# Altium schematic sheet uMultimeter__Sch_View.SchDoc
size A4; PageSetup: Record=PageOptions|CenterHorizontal=True|CenterVertical=True|PrintScale=1.00|XCorrection=1.00|YCorrection=1.00|PrintKind=0|BorderSize=5000000|LeftOffset=0|BottomOffset=0|Orientation=2|PaperLength=1000|PaperWidth=1000|Scale=100|PaperSource=7|PrintQuality=-3|MediaType=1|DitherType=10|PrintScaleMode=0|PaperKind=A4|PaperIndex=9
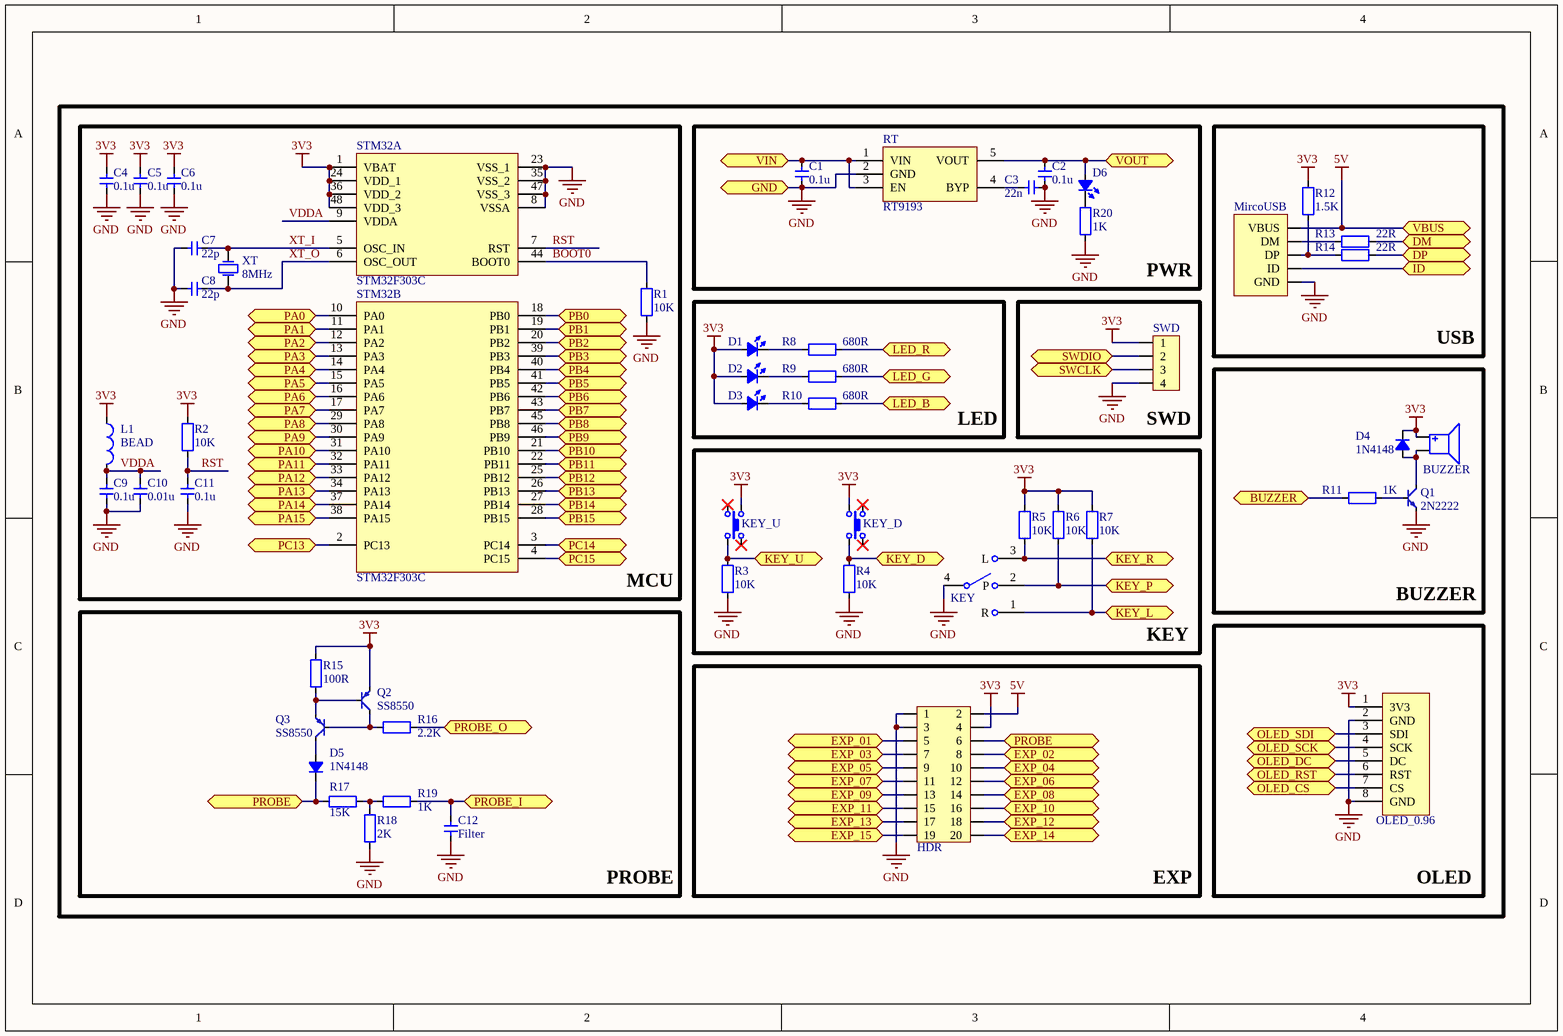
[diagram p0: uMultimeter__Sch_View.SchDoc]

## Parts
BUZZER  Buzzer  [Buzzer_5x5]  (value not drawn)
C1  value 0.1u  [CAP_0603]  (hidden comment: Cap_0603)
C2  value 0.1u  [CAP_0603]  (hidden comment: Cap_0603)
C3  value 22n  [CAP_0603]  (hidden comment: Cap_0603)
C4  value 0.1u  [CAP_0603]  (hidden comment: Cap_0603)
C5  value 0.1u  [CAP_0603]  (hidden comment: Cap_0603)
C6  value 0.1u  [CAP_0603]  (hidden comment: Cap_0603)
C7  value 22p  [CAP_0603]  (hidden comment: Cap_0603)
C8  value 22p  [CAP_0603]  (hidden comment: Cap_0603)
C9  value 0.1u  [CAP_0603]  (hidden comment: Cap_0603)
C10  value 0.01u  [CAP_0603]  (hidden comment: Cap_0603)
C11  value 0.1u  [CAP_0603]  (hidden comment: Cap_0603)
C12  value Filter  [CAP_0603]  (hidden comment: Cap_0603)
D1  LED_0805  [LED_0805_RED]  (value not drawn)
D2  LED_0805  [LED_0805_GREEN]  (value not drawn)
D3  LED_0805  [LED_0805_BLUE]  (value not drawn)
D4  value 1N4148  [SOD-323]  (hidden comment: Diode_SOD323)
D5  value 1N4148  [SOD-323]  (hidden comment: Diode_SOD323)
D6  LED_0805  [LED_0805_ORANGE]  (value not drawn)
HDR  HDR2x10_2.54  [HDR2X10_2.54_180HF]  (value not drawn)
KEY  ButtonPushLever_11*12_90  [ButtonPushLever_11*12_90]  (value not drawn)
KEY_D  ButtonTACT  [ButtonTACT_3.5*3.55_90]  (value not drawn)
KEY_U  ButtonTACT  [ButtonTACT_3.5*3.55_90]  (value not drawn)
L1  value BEAD  [IND_0603]  (hidden comment: Ind_0603)
MircoUSB  USB_Micro  [USB_Micro-AB]  (value not drawn)
OLED_0.96  OLED_0.96  [OLED_0.96_96x64_v2]  (value not drawn)
Q1  value 2N2222  [SOT23-3]  (hidden comment: BJT_NPN)
Q2  value SS8550  [SOT23-3]  (hidden comment: BJT_PNP)
Q3  value SS8550  [SOT23-3]  (hidden comment: BJT_PNP)
R1  value 10K  [RES_0603]  (hidden comment: Res_0603)
R2  value 10K  [RES_0603]  (hidden comment: Res_0603)
R3  value 10K  [RES_0603]  (hidden comment: Res_0603)
R4  value 10K  [RES_0603]  (hidden comment: Res_0603)
R5  value 10K  [RES_0603]  (hidden comment: Res_0603)
R6  value 10K  [RES_0603]  (hidden comment: Res_0603)
R7  value 10K  [RES_0603]  (hidden comment: Res_0603)
R8  value 680R  [RES_0603]  (hidden comment: Res_0603)
R9  value 680R  [RES_0603]  (hidden comment: Res_0603)
R10  value 680R  [RES_0603]  (hidden comment: Res_0603)
R11  value 1K  [RES_0603]  (hidden comment: Res_0603)
R12  value 1.5K  [RES_0603]  (hidden comment: Res_0603)
R13  value 22R  [RES_0603]  (hidden comment: Res_0603)
R14  value 22R  [RES_0603]  (hidden comment: Res_0603)
R15  value 100R  [RES_0603]  (hidden comment: Res_0603)
R16  value 2.2K  [RES_0603]  (hidden comment: Res_0603)
R17  value 15K  [RES_0603]  (hidden comment: Res_0603)
R18  value 2K  [RES_0603]  (hidden comment: Res_0603)
R19  value 1K  [RES_0603]  (hidden comment: Res_0603)
R20  value 1K  [RES_0603]  (hidden comment: Res_0603)
RT  RT9193  [SOT23-5]
STM32  STM32F303C  [LQFP_P0.5_48]  (parts A,B of 2)
SWD  HDR1x4_1.27  [HDR1X4_1.27_180]  (value not drawn)
XT  value 8MHz  [XT_5032_2]  (hidden comment: XTAL_5032_2P)

## Blocks framed on the sheet
MCU: C4-C11 L1 R1 R2 STM32 XT
PWR: C1-C3 D6 R20 RT
USB: MircoUSB R12-R14
LED: D1-D3 R8-R10
SWD: SWD
BUZZER: BUZZER D4 Q1 R11
KEY: KEY KEY_D KEY_U R3-R7
PROBE: C12 D5 Q2 Q3 R15-R19
OLED: OLED_0.96
EXP: HDR

## Ports
BUZZER, DM, DP, EXP_01, EXP_02, EXP_03, EXP_04, EXP_05, EXP_06, EXP_07, EXP_08, EXP_09, EXP_10, EXP_11, EXP_12, EXP_13, EXP_14, EXP_15, GND, ID, KEY_D, KEY_L, KEY_P, KEY_R, KEY_U, LED_B, LED_G, LED_R, OLED_CS, OLED_DC, OLED_RST, OLED_SCK, OLED_SDI, PA0, PA1, PA2, PA3, PA4, PA5, PA6, PA7, PA8, PA9, PA10, PA11, PA12, PA13, PA14, PA15, PB0, PB1, PB2, PB3, PB4, PB5, PB6, PB7, PB8, PB9, PB10, PB11, PB12, PB13, PB14, PB15, PC13, PC14, PC15, PROBE, PROBE_I, PROBE_O, SWCLK, SWDIO, VBUS, VIN, VOUT

## Nets
3V3: BUZZER.P(Positive) C4.2 C5.2 C6.2 D1.1(A) D2.1(A) D3.1(A) D4.2(K) HDR.4 KEY_D.3 KEY_U.1 L1.1 OLED_0.96.1(3V3) Q2.2(E) R2.2 R5.2 R6.2 R7.2 R12.1 R15.2 STM32.1(VBAT) STM32.24(VDD_1) STM32.36(VDD_2) STM32.48(VDD_3) SWD.1
5V: HDR.2 MircoUSB.1(VBUS) ; port VBUS
GND: C1.1 C2.1 C3.1 C4.1 C5.1 C6.1 C7.2 C8.2 C9.1 C10.1 C11.1 C12.1 HDR.1 HDR.3 KEY.4 MircoUSB.5(GND) OLED_0.96.2(GND) OLED_0.96.8(GND) Q1.2(E) R1.1 R3.1 R4.1 R18.2 R20.2 RT.2(GND) STM32.8(VSSA) STM32.23(VSS_1) STM32.35(VSS_2) STM32.47(VSS_3) SWD.4 ; port GND
BOOT0: R1.2 STM32.44(BOOT0)
BUZZER: R11.2 ; port BUZZER
DM: R13.2 ; port DM
DP: R14.2 ; port DP
EXP_01: HDR.5 ; port EXP_01
EXP_02: HDR.8 ; port EXP_02
EXP_03: HDR.7 ; port EXP_03
EXP_04: HDR.10 ; port EXP_04
EXP_05: HDR.9 ; port EXP_05
EXP_06: HDR.12 ; port EXP_06
EXP_07: HDR.11 ; port EXP_07
EXP_08: HDR.14 ; port EXP_08
EXP_09: HDR.13 ; port EXP_09
EXP_10: HDR.16 ; port EXP_10
EXP_11: HDR.15 ; port EXP_11
EXP_12: HDR.18 ; port EXP_12
EXP_13: HDR.17 ; port EXP_13
EXP_14: HDR.20 ; port EXP_14
EXP_15: HDR.19 ; port EXP_15
ID: MircoUSB.4(ID) ; port ID
KEY_D: KEY_D.4 R4.2 ; port KEY_D
KEY_L: KEY.1(R) R7.1 ; port KEY_L
KEY_P: KEY.2(P) R6.1 ; port KEY_P
KEY_R: KEY.3(L) R5.1 ; port KEY_R
KEY_U: KEY_U.4 R3.2 ; port KEY_U
LED_B: R10.2 ; port LED_B
LED_G: R9.1 ; port LED_G
LED_R: R8.1 ; port LED_R
OLED_CS: OLED_0.96.7(CS) ; port OLED_CS
OLED_DC: OLED_0.96.5(DC) ; port OLED_DC
OLED_RST: OLED_0.96.6(RST) ; port OLED_RST
OLED_SCK: OLED_0.96.4(SCK) ; port OLED_SCK
OLED_SDI: OLED_0.96.3(SDI) ; port OLED_SDI
PA0: STM32.10(PA0) ; port PA0
PA1: STM32.11(PA1) ; port PA1
PA2: STM32.12(PA2) ; port PA2
PA3: STM32.13(PA3) ; port PA3
PA4: STM32.14(PA4) ; port PA4
PA5: STM32.15(PA5) ; port PA5
PA6: STM32.16(PA6) ; port PA6
PA7: STM32.17(PA7) ; port PA7
PA8: STM32.29(PA8) ; port PA8
PA9: STM32.30(PA9) ; port PA9
PA10: STM32.31(PA10) ; port PA10
PA11: STM32.32(PA11) ; port PA11
PA12: STM32.33(PA12) ; port PA12
PA13: STM32.34(PA13) ; port PA13
PA14: STM32.37(PA14) ; port PA14
PA15: STM32.38(PA15) ; port PA15
PB0: STM32.18(PB0) ; port PB0
PB1: STM32.19(PB1) ; port PB1
PB2: STM32.20(PB2) ; port PB2
PB3: STM32.39(PB3) ; port PB3
PB4: STM32.40(PB4) ; port PB4
PB5: STM32.41(PB5) ; port PB5
PB6: STM32.42(PB6) ; port PB6
PB7: STM32.43(PB7) ; port PB7
PB8: STM32.45(PB8) ; port PB8
PB9: STM32.46(PB9) ; port PB9
PB10: STM32.21(PB10) ; port PB10
PB11: STM32.22(PB11) ; port PB11
PB12: STM32.25(PB12) ; port PB12
PB13: STM32.26(PB13) ; port PB13
PB14: STM32.27(PB14) ; port PB14
PB15: STM32.28(PB15) ; port PB15
PC13: STM32.2(PC13) ; port PC13
PC14: STM32.3(PC14) ; port PC14
PC15: STM32.4(PC15) ; port PC15
PROBE: D5.2(K) HDR.6 R17.2 ; port PROBE
PROBE_I: C12.2 R19.2 ; port PROBE_I
PROBE_O: R16.1 ; port PROBE_O
RST: C11.2 R2.1 STM32.7(RST)
SWCLK: SWD.3 ; port SWCLK
SWDIO: SWD.2 ; port SWDIO
VDDA: C9.2 C10.2 L1.2 STM32.9(VDDA)
VIN: C1.2 RT.1(VIN) RT.3(EN) ; port VIN
VOUT: C2.2 D6.1(A) RT.5(VOUT) ; port VOUT
XT_I: C7.1 STM32.5(OSC_IN) XT.2(OSC2)
XT_O: C8.1 STM32.6(OSC_OUT) XT.1(OSC1)
NetBUZZER_N: BUZZER.N(Negative) D4.1(A) Q1.3(C)
NetC3_2: C3.2 RT.4(BYP)
NetD1_2: D1.2(K) R8.2
NetD2_2: D2.2(K) R9.2
NetD3_2: D3.2(K) R10.1
NetD5_1: D5.1(A) Q3.3(C)
NetD6_2: D6.2(K) R20.1
NetMircoUSB_2: MircoUSB.2(DM) R13.1
NetMircoUSB_3: MircoUSB.3(DP) R12.2 R14.1
NetQ1_1: Q1.1(B) R11.1
NetQ2_1: Q2.1(B) Q3.2(E) R15.1
NetQ2_3: Q2.3(C) Q3.1(B) R16.2
NetR17_1: R17.1 R18.1 R19.1

Not connected (* = marked no-connect by the designer): KEY_D 1* 2*; KEY_U 2* 3*

## Library data of the parts
C1-C12 = Cap_0603: Capacitor
D1-D3 D6 = LED_0805: LED
D4 D5 = Diode_SOD323: Diode
HDR = HDR2x10_2.54: Header
KEY = ButtonPushLever_11*12_90: Button
KEY_D KEY_U = ButtonTACT: Button
L1 = Ind_0603: Inductor
MircoUSB = USB_Micro: USB
OLED_0.96 = OLED_0.96_96*64_v2: Module
Q1 = BJT_NPN: Transistor
Q2 Q3 = BJT_PNP: Transistor
R1-R20 = Res_0603: Resistor
RT = SP6205: Power
STM32 = STM32F303C: MCU
SWD = HDR1x4_1.27: Header
XT = XTAL_5032_2P: Crystal Oscillator